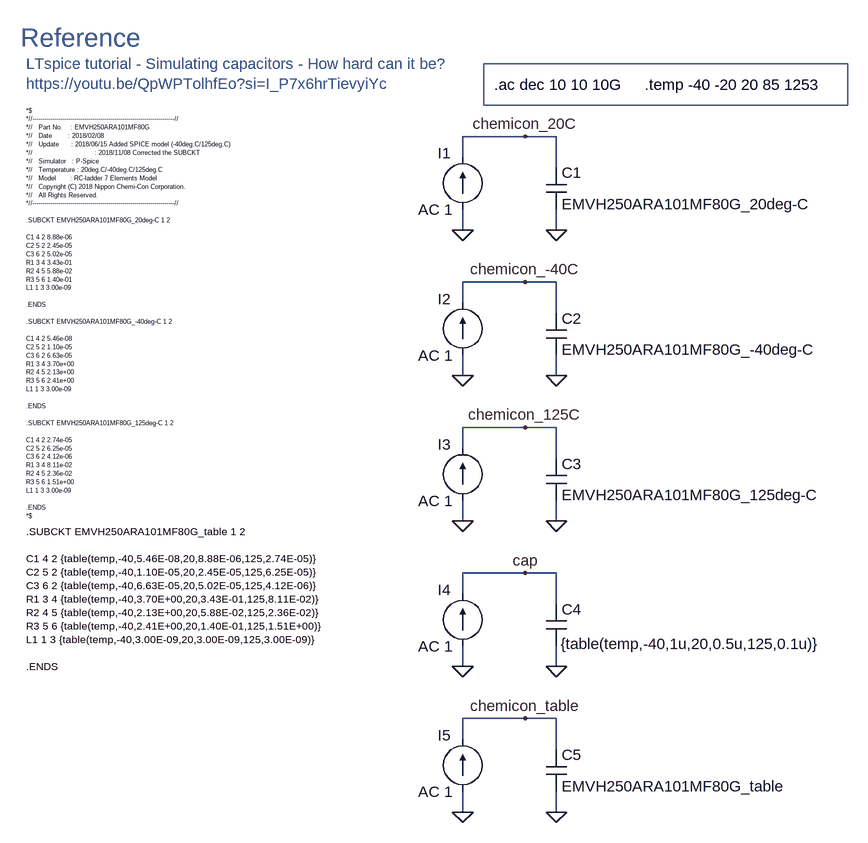
[diagram p0: schematic 06-EMVH250ARA101MF80G_impedance_table.asc]
06-EMVH250ARA101MF80G_impedance_table.asc, the LTspice schematic file:
Version 4
SHEET 1 1452 1420
WIRE 512 336 416 336
WIRE 560 336 512 336
WIRE 416 368 416 336
WIRE 560 384 560 336
WIRE 416 480 416 448
WIRE 560 480 560 448
WIRE 512 560 416 560
WIRE 560 560 512 560
WIRE 416 592 416 560
WIRE 560 608 560 560
WIRE 416 704 416 672
WIRE 560 704 560 672
WIRE 512 784 416 784
WIRE 560 784 512 784
WIRE 416 816 416 784
WIRE 560 832 560 784
WIRE 416 928 416 896
WIRE 560 928 560 896
WIRE 512 1008 416 1008
WIRE 560 1008 512 1008
WIRE 416 1040 416 1008
WIRE 560 1056 560 1008
WIRE 416 1152 416 1120
WIRE 560 1152 560 1120
WIRE 512 1232 416 1232
WIRE 560 1232 512 1232
WIRE 416 1264 416 1232
WIRE 560 1280 560 1232
WIRE 416 1376 416 1344
WIRE 560 1376 560 1344
FLAG 416 480 0
FLAG 560 480 0
FLAG 512 336 chemicon_20C
FLAG 416 704 0
FLAG 560 704 0
FLAG 512 560 chemicon_-40C
FLAG 416 928 0
FLAG 560 928 0
FLAG 512 784 chemicon_125C
FLAG 416 1152 0
FLAG 560 1152 0
FLAG 512 1008 cap
FLAG 416 1376 0
FLAG 560 1376 0
FLAG 512 1232 chemicon_table
SYMBOL current 416 448 R180
WINDOW 0 18 86 Left 2
WINDOW 3 24 0 Left 2
WINDOW 123 15 -1 Left 2
WINDOW 39 0 0 Left 0
SYMATTR InstName I1
SYMATTR Value ""
SYMATTR Value2 AC 1
SYMBOL cap 544 384 R0
SYMATTR InstName C1
SYMATTR Value EMVH250ARA101MF80G_20deg-C
SYMATTR Prefix X
SYMBOL current 416 672 R180
WINDOW 0 18 86 Left 2
WINDOW 3 24 0 Left 2
WINDOW 123 15 -1 Left 2
WINDOW 39 0 0 Left 0
SYMATTR InstName I2
SYMATTR Value ""
SYMATTR Value2 AC 1
SYMBOL cap 544 608 R0
SYMATTR InstName C2
SYMATTR Value EMVH250ARA101MF80G_-40deg-C
SYMATTR Prefix X
SYMBOL current 416 896 R180
WINDOW 0 18 86 Left 2
WINDOW 3 24 0 Left 2
WINDOW 123 15 -1 Left 2
WINDOW 39 0 0 Left 0
SYMATTR InstName I3
SYMATTR Value ""
SYMATTR Value2 AC 1
SYMBOL cap 544 832 R0
SYMATTR InstName C3
SYMATTR Value EMVH250ARA101MF80G_125deg-C
SYMATTR Prefix X
SYMBOL current 416 1120 R180
WINDOW 0 18 86 Left 2
WINDOW 3 24 0 Left 2
WINDOW 123 15 -1 Left 2
WINDOW 39 0 0 Left 0
SYMATTR InstName I4
SYMATTR Value ""
SYMATTR Value2 AC 1
SYMBOL cap 544 1056 R0
WINDOW 39 23 61 Left 2
SYMATTR InstName C4
SYMATTR Value ""
SYMATTR SpiceLine {table(temp,-40,1u,20,0.5u,125,0.1u)}
SYMBOL current 416 1344 R180
WINDOW 0 18 86 Left 2
WINDOW 3 24 0 Left 2
WINDOW 123 15 -1 Left 2
WINDOW 39 0 0 Left 0
SYMATTR InstName I5
SYMATTR Value ""
SYMATTR Value2 AC 1
SYMBOL cap 544 1280 R0
SYMATTR InstName C5
SYMATTR Value EMVH250ARA101MF80G_table
SYMATTR Prefix X
TEXT -256 296 Left 0 !*$\n*//-----------------------------------------------------------------------//\n*//   Part No.    : EMVH250ARA101MF80G\n*//   Date        : 2018/02/08\n*//   Update      : 2018/06/15 Added SPICE model (-40deg.C/125deg.C)\n*//                               : 2018/11/08 Corrected the SUBCKT\n*//   Simulator   : P-Spice\n*//   Temperature : 20deg.C/-40deg.C/125deg.C\n*//   Model       : RC-ladder 7 Elements Model\n*//   Copyright (C) 2018 Nippon Chemi-Con Corporation.\n*//   All Rights Reserved.\n*//-----------------------------------------------------------------------//\n \n.SUBCKT EMVH250ARA101MF80G_20deg-C 1 2\n \nC1 4 2 8.88e-06\nC2 5 2 2.45e-05\nC3 6 2 5.02e-05\nR1 3 4 3.43e-01\nR2 4 5 5.88e-02\nR3 5 6 1.40e-01\nL1 1 3 3.00e-09\n \n.ENDS\n \n.SUBCKT EMVH250ARA101MF80G_-40deg-C 1 2\n \nC1 4 2 5.46e-08\nC2 5 2 1.10e-05\nC3 6 2 6.63e-05\nR1 3 4 3.70e+00\nR2 4 5 2.13e+00\nR3 5 6 2.41e+00\nL1 1 3 3.00e-09\n \n.ENDS\n \n.SUBCKT EMVH250ARA101MF80G_125deg-C 1 2\n \nC1 4 2 2.74e-05\nC2 5 2 6.25e-05\nC3 6 2 4.12e-06\nR1 3 4 8.11e-02\nR2 4 5 2.36e-02\nR3 5 6 1.51e+00\nL1 1 3 3.00e-09\n \n.ENDS\n*$
TEXT 464 256 Left 2 !.ac dec 10 10 10G
TEXT -256 224 Left 2 ;LTspice tutorial - Simulating capacitors - How hard can it be?\nhttps://youtu.be/QpWPTolhfEo?si=I_P7x6hrTievyiYc
TEXT -264 184 Left 4 ;Reference
TEXT 696 256 Left 2 !.temp -40 -20 20 85 1253
TEXT -256 944 Left 1 !.SUBCKT EMVH250ARA101MF80G_table 1 2\n \nC1 4 2 {table(temp,-40,5.46E-08,20,8.88E-06,125,2.74E-05)}\nC2 5 2 {table(temp,-40,1.10E-05,20,2.45E-05,125,6.25E-05)}\nC3 6 2 {table(temp,-40,6.63E-05,20,5.02E-05,125,4.12E-06)}\nR1 3 4 {table(temp,-40,3.70E+00,20,3.43E-01,125,8.11E-02)}\nR2 4 5 {table(temp,-40,2.13E+00,20,5.88E-02,125,2.36E-02)}\nR3 5 6 {table(temp,-40,2.41E+00,20,1.40E-01,125,1.51E+00)}\nL1 1 3 {table(temp,-40,3.00E-09,20,3.00E-09,125,3.00E-09)}\n \n.ENDS
RECTANGLE Normal 448 288 1008 224

The netlist it stands for:
* 06-EMVH250ARA101MF80G_impedance_table.asc
I1 0 chemicon_20C AC 1
XC1 chemicon_20C 0 EMVH250ARA101MF80G_20deg-C  ; pins A B
I2 0 chemicon_-40C AC 1
XC2 chemicon_-40C 0 EMVH250ARA101MF80G_-40deg-C  ; pins A B
I3 0 chemicon_125C AC 1
XC3 chemicon_125C 0 EMVH250ARA101MF80G_125deg-C  ; pins A B
I4 0 cap AC 1
C4 cap 0 {table(temp,-40,1u,20,0.5u,125,0.1u)}
I5 0 chemicon_table AC 1
XC5 chemicon_table 0 EMVH250ARA101MF80G_table  ; pins A B
*$
*//-----------------------------------------------------------------------//
*//   Part No.    : EMVH250ARA101MF80G
*//   Date        : 2018/02/08
*//   Update      : 2018/06/15 Added SPICE model (-40deg.C/125deg.C)
*//                               : 2018/11/08 Corrected the SUBCKT
*//   Simulator   : P-Spice
*//   Temperature : 20deg.C/-40deg.C/125deg.C
*//   Model       : RC-ladder 7 Elements Model
*//   Copyright (C) 2018 Nippon Chemi-Con Corporation.
*//   All Rights Reserved.
*//-----------------------------------------------------------------------//
.SUBCKT EMVH250ARA101MF80G_20deg-C 1 2
C1 4 2 8.88e-06
C2 5 2 2.45e-05
C3 6 2 5.02e-05
R1 3 4 3.43e-01
R2 4 5 5.88e-02
R3 5 6 1.40e-01
L1 1 3 3.00e-09
.ENDS
.SUBCKT EMVH250ARA101MF80G_-40deg-C 1 2
C1 4 2 5.46e-08
C2 5 2 1.10e-05
C3 6 2 6.63e-05
R1 3 4 3.70e+00
R2 4 5 2.13e+00
R3 5 6 2.41e+00
L1 1 3 3.00e-09
.ENDS
.SUBCKT EMVH250ARA101MF80G_125deg-C 1 2
C1 4 2 2.74e-05
C2 5 2 6.25e-05
C3 6 2 4.12e-06
R1 3 4 8.11e-02
R2 4 5 2.36e-02
R3 5 6 1.51e+00
L1 1 3 3.00e-09
.ENDS
*$
.ac dec 10 10 10G
* LTspice tutorial - Simulating capacitors - How hard can it be?
* https://youtu.be/QpWPTolhfEo?si=I_P7x6hrTievyiYc
* Reference
.temp -40 -20 20 85 1253
.SUBCKT EMVH250ARA101MF80G_table 1 2
C1 4 2 {table(temp,-40,5.46E-08,20,8.88E-06,125,2.74E-05)}
C2 5 2 {table(temp,-40,1.10E-05,20,2.45E-05,125,6.25E-05)}
C3 6 2 {table(temp,-40,6.63E-05,20,5.02E-05,125,4.12E-06)}
R1 3 4 {table(temp,-40,3.70E+00,20,3.43E-01,125,8.11E-02)}
R2 4 5 {table(temp,-40,2.13E+00,20,5.88E-02,125,2.36E-02)}
R3 5 6 {table(temp,-40,2.41E+00,20,1.40E-01,125,1.51E+00)}
L1 1 3 {table(temp,-40,3.00E-09,20,3.00E-09,125,3.00E-09)}
.ENDS
.backanno
.end

* Results of the author's LTspice run, read from the files saved beside the schematic
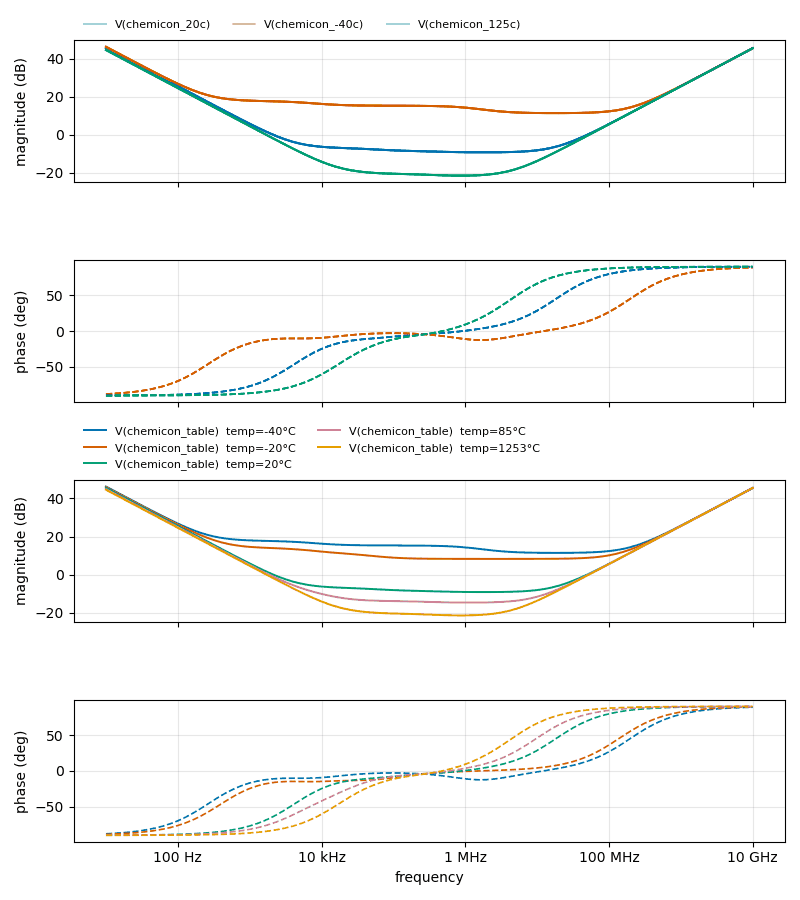
[diagram p1: AC Analysis of 06-EMVH250ARA101MF80G_impedance_table.asc, plotted from the saved traces]
* AC Analysis, 5 runs:
*   V(chemicon_20c) [temp=-40°C]: 45.59 dB at 10 Hz, 45.51 dB at 10 GHz, peak 45.59 dB at 10 Hz, 3 dB below the peak at 14.14 Hz
*   V(chemicon_20c) [temp=-20°C]: 45.59 dB at 10 Hz, 45.51 dB at 10 GHz, peak 45.59 dB at 10 Hz, 3 dB below the peak at 14.14 Hz
*   V(chemicon_20c) [temp=20°C]: 45.59 dB at 10 Hz, 45.51 dB at 10 GHz, peak 45.59 dB at 10 Hz, 3 dB below the peak at 14.14 Hz
*   V(chemicon_20c) [temp=85°C]: 45.59 dB at 10 Hz, 45.51 dB at 10 GHz, peak 45.59 dB at 10 Hz, 3 dB below the peak at 14.14 Hz
*   V(chemicon_20c) [temp=1253°C]: 45.59 dB at 10 Hz, 45.51 dB at 10 GHz, peak 45.59 dB at 10 Hz, 3 dB below the peak at 14.14 Hz
*   V(chemicon_-40c) [temp=-40°C]: 46.27 dB at 10 Hz, 45.51 dB at 10 GHz, peak 46.27 dB at 10 Hz, 3 dB below the peak at 14.15 Hz
*   V(chemicon_-40c) [temp=-20°C]: 46.27 dB at 10 Hz, 45.51 dB at 10 GHz, peak 46.27 dB at 10 Hz, 3 dB below the peak at 14.15 Hz
*   V(chemicon_-40c) [temp=20°C]: 46.27 dB at 10 Hz, 45.51 dB at 10 GHz, peak 46.27 dB at 10 Hz, 3 dB below the peak at 14.15 Hz
*   V(chemicon_-40c) [temp=85°C]: 46.27 dB at 10 Hz, 45.51 dB at 10 GHz, peak 46.27 dB at 10 Hz, 3 dB below the peak at 14.15 Hz
*   V(chemicon_-40c) [temp=1253°C]: 46.27 dB at 10 Hz, 45.51 dB at 10 GHz, peak 46.27 dB at 10 Hz, 3 dB below the peak at 14.15 Hz
*   V(chemicon_125c) [temp=-40°C]: 44.57 dB at 10 Hz, 45.51 dB at 10 GHz, peak 45.51 dB at 10 GHz, 3 dB below the peak at 7.071 GHz
*   V(chemicon_125c) [temp=-20°C]: 44.57 dB at 10 Hz, 45.51 dB at 10 GHz, peak 45.51 dB at 10 GHz, 3 dB below the peak at 7.071 GHz
*   V(chemicon_125c) [temp=20°C]: 44.57 dB at 10 Hz, 45.51 dB at 10 GHz, peak 45.51 dB at 10 GHz, 3 dB below the peak at 7.071 GHz
*   V(chemicon_125c) [temp=85°C]: 44.57 dB at 10 Hz, 45.51 dB at 10 GHz, peak 45.51 dB at 10 GHz, 3 dB below the peak at 7.071 GHz
*   V(chemicon_125c) [temp=1253°C]: 44.57 dB at 10 Hz, 45.51 dB at 10 GHz, peak 45.51 dB at 10 GHz, 3 dB below the peak at 7.071 GHz
*   V(chemicon_table) [temp=-40°C]: 46.27 dB at 10 Hz, 45.51 dB at 10 GHz, peak 46.27 dB at 10 Hz, 3 dB below the peak at 14.15 Hz
*   V(chemicon_table) [temp=-20°C]: 46.04 dB at 10 Hz, 45.51 dB at 10 GHz, peak 46.04 dB at 10 Hz, 3 dB below the peak at 14.15 Hz
*   V(chemicon_table) [temp=20°C]: 45.59 dB at 10 Hz, 45.51 dB at 10 GHz, peak 45.59 dB at 10 Hz, 3 dB below the peak at 14.14 Hz
*   V(chemicon_table) [temp=85°C]: 44.95 dB at 10 Hz, 45.51 dB at 10 GHz, peak 45.51 dB at 10 GHz, 3 dB below the peak at 7.071 GHz
*   V(chemicon_table) [temp=1253°C]: 44.57 dB at 10 Hz, 45.51 dB at 10 GHz, peak 45.51 dB at 10 GHz, 3 dB below the peak at 7.071 GHz